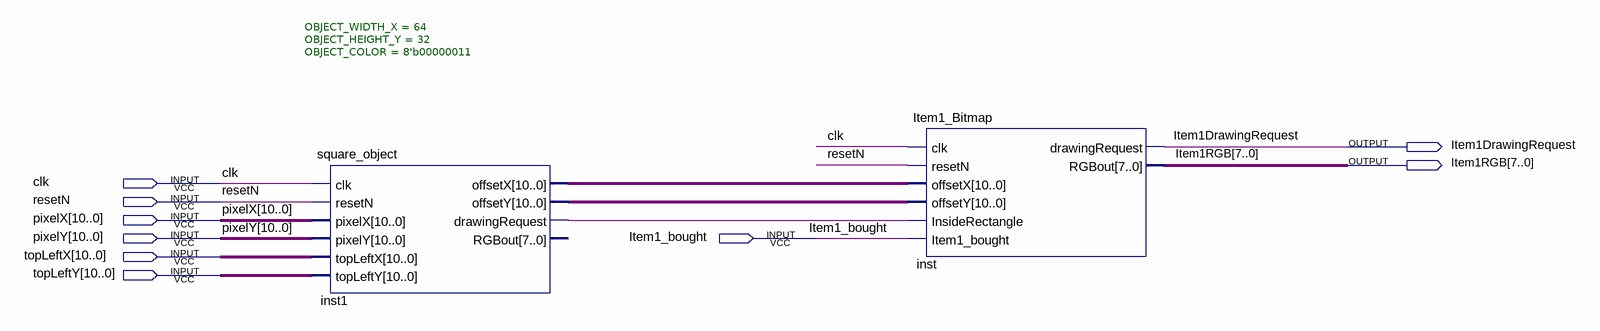
[diagram p0: schematic sheet]
// Quartus schematic Item1_Display.bdf as structural Verilog: 2 symbols, 9 pins
module Item1_Display (
  input  clk,
  input  resetN,
  input  [10:0] pixelX,
  input  [10:0] pixelY,
  input  Item1_bought,
  input  [10:0] topLeftX,
  input  [10:0] topLeftY,
  output Item1DrawingRequest,
  output [7:0] Item1RGB
);

  wire inst1_drawingrequest;
  wire [10:0] inst1_offsetx, inst1_offsety;

  square_object #(.OBJECT_WIDTH_X(64), .OBJECT_HEIGHT_Y(32), .OBJECT_COLOR(8'b00000011)) inst1 (
    .clk(clk), .resetN(resetN), .pixelX(pixelX), .pixelY(pixelY), .topLeftX(topLeftX), .topLeftY(topLeftY),
    .offsetX(inst1_offsetx), .offsetY(inst1_offsety), .drawingRequest(inst1_drawingrequest));  // open: RGBout
  Item1_Bitmap inst (
    .clk(clk), .resetN(resetN), .offsetX(inst1_offsetx), .offsetY(inst1_offsety),
    .InsideRectangle(inst1_drawingrequest), .Item1_bought(Item1_bought),
    .drawingRequest(Item1DrawingRequest), .RGBout(Item1RGB));
endmodule
